# EAGLE design SeismicPi (EAGLE 7.3.0)
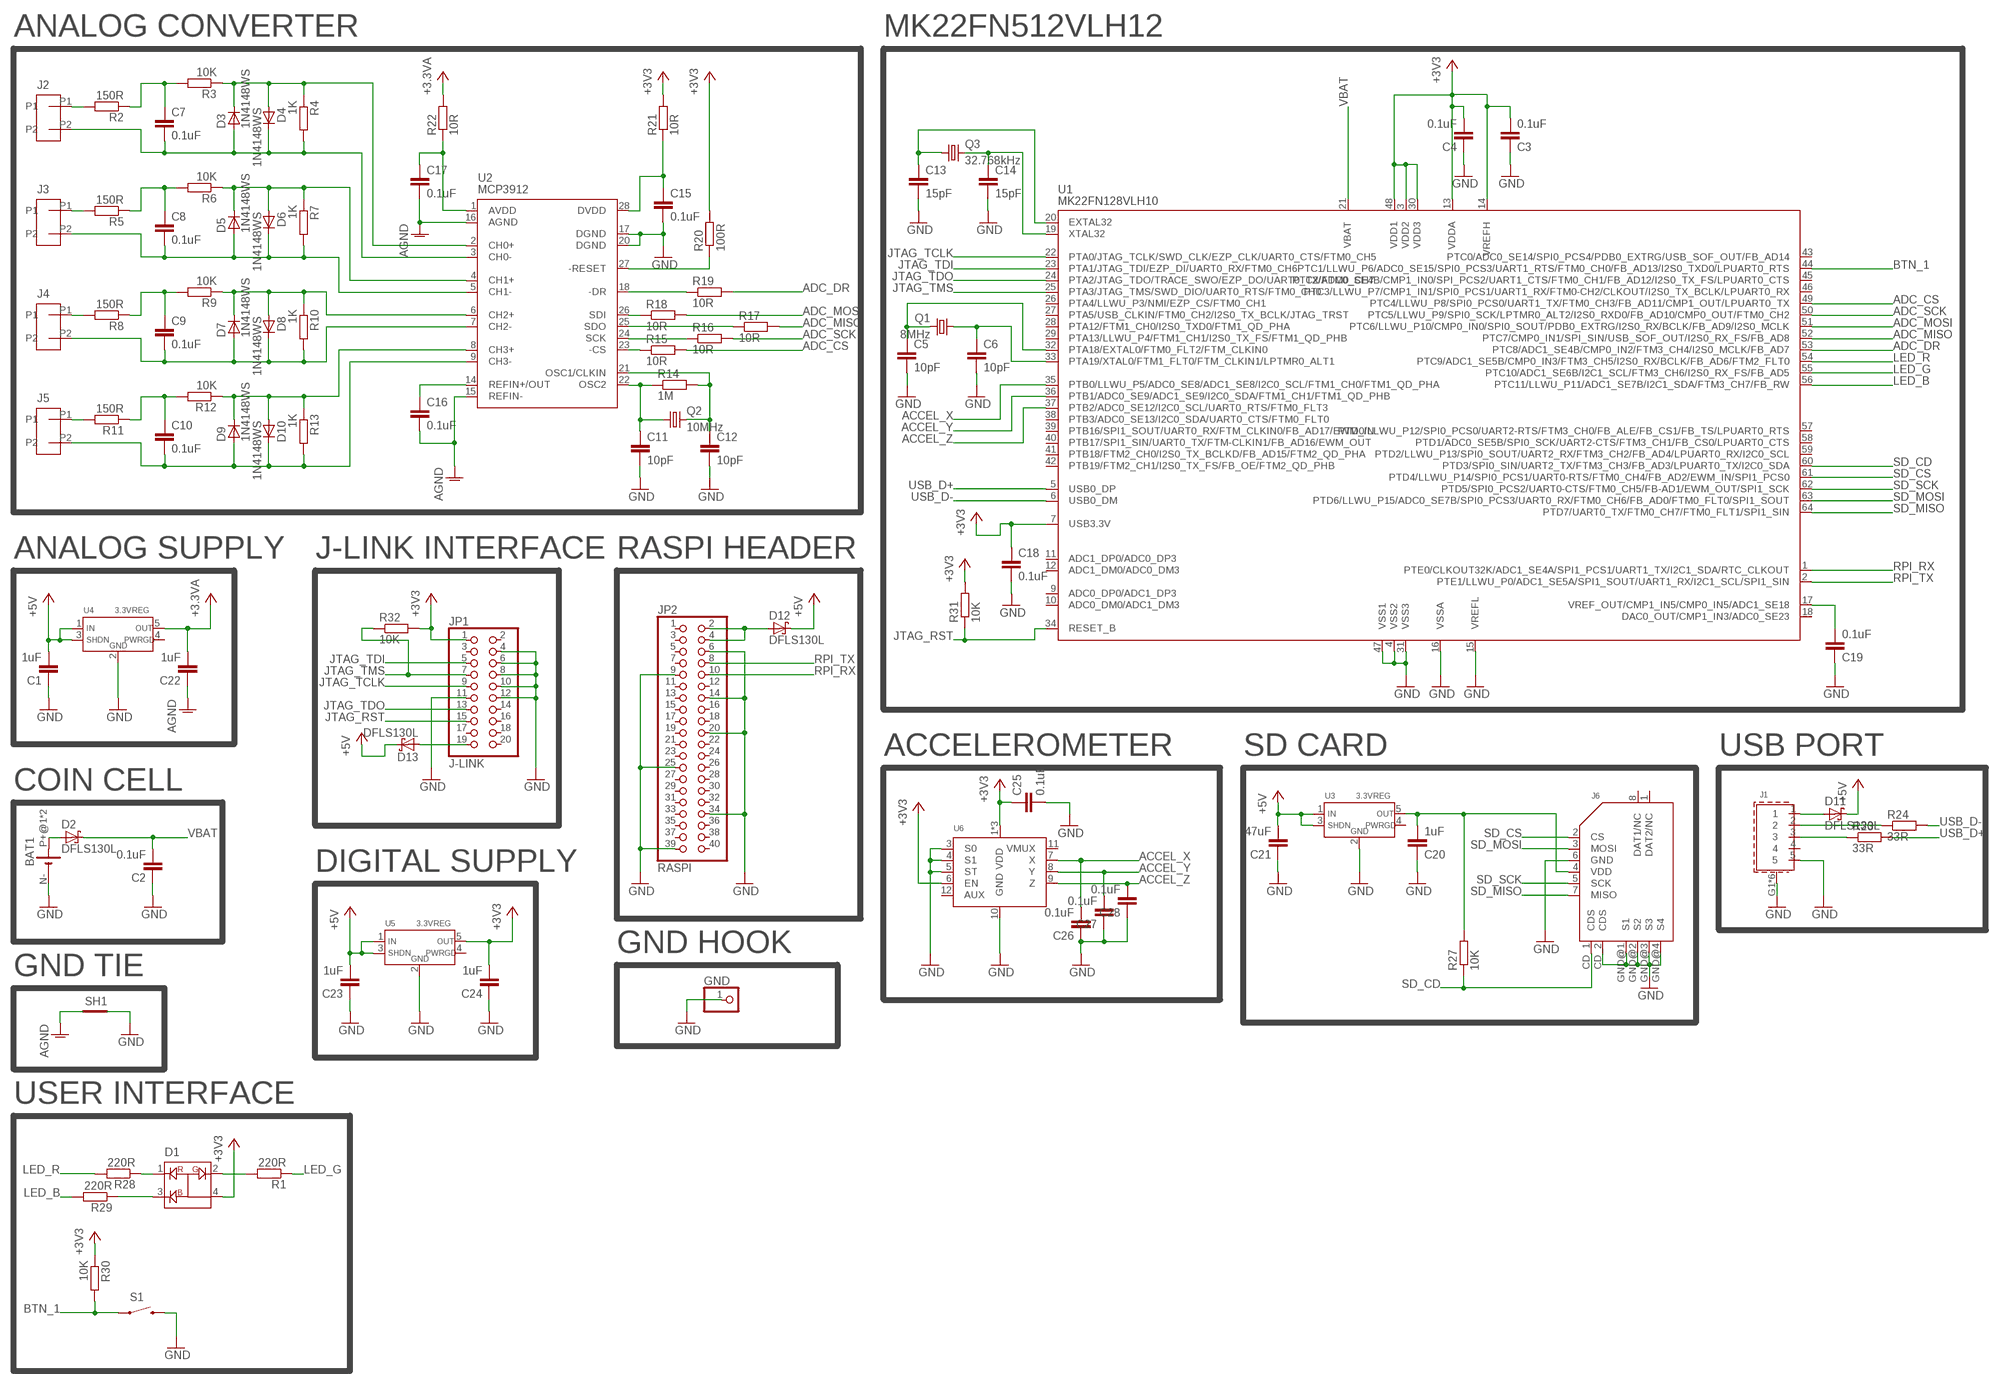
[diagram p0: schematic, sheet 1]

## Parts
BAT1  BATTERY-HOLDER_11.6MM  [CELL_RETAINER_11.6MM]
C1  1uF  C-EUC2012  [C2012]
C2  0.1uF  C-EUC2012  [C2012]
C3  0.1uF  C-EUC2012  [C2012]
C4  0.1uF  C-EUC2012  [C2012]
C5  10pF  C-EUC2012  [C2012]
C6  10pF  C-EUC2012  [C2012]
C7  0.1uF  C-EUC2012  [C2012]
C8  0.1uF  C-EUC2012  [C2012]
C9  0.1uF  C-EUC2012  [C2012]
C10  0.1uF  C-EUC2012  [C2012]
C11  10pF  C-EUC2012  [C2012]
C12  10pF  C-EUC2012  [C2012]
C13  15pF  C-EUC2012  [C2012]
C14  15pF  C-EUC2012  [C2012]
C15  0.1uF  C-EUC2012  [C2012]
C16  0.1uF  C-EUC2012  [C2012]
C17  0.1uF  C-EUC2012  [C2012]
C18  0.1uF  C-EUC2012  [C2012]
C19  0.1uF  C-EUC2012  [C2012]
C20  1uF  C-EUC2012  [C2012]
C21  47uF  C-EUC2012  [C2012]
C22  1uF  C-EUC2012  [C2012]
C23  1uF  C-EUC2012  [C2012]
C24  1uF  C-EUC2012  [C2012]
C25  0.1uF  C-EUC2012  [C2012]
C26  0.1uF  C-EUC2012  [C2012]
C27  0.1uF  C-EUC2012  [C2012]
C28  0.1uF  C-EUC2012  [C2012]
D1  RGB-LED  [P-LCC4-0]
D2  DFLS130L  [POWERDI323]
D3  1N4148WS  [SOD323]
D4  1N4148WS  [SOD323]
D5  1N4148WS  [SOD323]
D6  1N4148WS  [SOD323]
D7  1N4148WS  [SOD323]
D8  1N4148WS  [SOD323]
D9  1N4148WS  [SOD323]
D10  1N4148WS  [SOD323]
D11  DFLS130L  [POWERDI323]
D12  DFLS130L  [POWERDI323]
D13  DFLS130L  [POWERDI323]
GND  PINHD-1X1  [1X01]
J1  USB-CONNMICRO  [MICRO-USB]
J2  2WAY-TERMINAL  [2WAY-5.08]
J3  2WAY-TERMINAL  [2WAY-5.08]
J4  2WAY-TERMINAL  [2WAY-5.08]
J5  2WAY-TERMINAL  [2WAY-5.08]
J6  MICRO-SD  [MICRO-SD]
JP1  J-LINK  PINHD-2X10  [2X10]
JP2  RASPI  PINHD-2X20  [2X20]
Q1  8MHz  CRYSTAL  [ABM3B]
Q2  10MHz  CRYSTAL  [ABM3B]
Q3  32.768kHz  CRYSTALMM20SS  [MM20SS]
R1  220R  R-EU_M2012  [M2012]
R2  150R  R-EU_M2012  [M2012]
R3  10K  R-EU_M2012  [M2012]
R4  1K  R-EU_M2012  [M2012]
R5  150R  R-EU_M2012  [M2012]
R6  10K  R-EU_M2012  [M2012]
R7  1K  R-EU_M2012  [M2012]
R8  150R  R-EU_M2012  [M2012]
R9  10K  R-EU_M2012  [M2012]
R10  1K  R-EU_M2012  [M2012]
R11  150R  R-EU_M2012  [M2012]
R12  10K  R-EU_M2012  [M2012]
R13  1K  R-EU_M2012  [M2012]
R14  1M  R-EU_M2012  [M2012]
R15  10R  R-EU_M2012  [M2012]
R16  10R  R-EU_M2012  [M2012]
R17  10R  R-EU_M2012  [M2012]
R18  10R  R-EU_M2012  [M2012]
R19  10R  R-EU_M2012  [M2012]
R20  100R  R-EU_M2012  [M2012]
R21  10R  R-EU_M2012  [M2012]
R22  10R  R-EU_M2012  [M2012]
R23  33R  R-EU_M2012  [M2012]
R24  33R  R-EU_M2012  [M2012]
R27  10K  R-EU_M2012  [M2012]
R28  220R  R-EU_M2012  [M2012]
R29  220R  R-EU_M2012  [M2012]
R30  10K  R-EU_M2012  [M2012]
R31  10K  R-EU_M2012  [M2012]
R32  10K  R-EU_M2012  [M2012]
S1  SWITCH-MOMENTARY-2PTH  [TACTILE-PTH]
SH1  SHORT-HT5  [SHORT_TOP-50]
U1  MK22FN128VLH10  [LQFP-64_10X10X1.6]
U2  MCP3912  [SSOP28]
U3  3.3VREG  [SOT23-5]
U4  3.3VREG  [SOT23-5]
U5  3.3VREG  [SOT23-5]
U6  KXRB5-2050  [LGA-14]

## Nets
+3V3: C3.2 C4.2 C18.1 C24.2 C25.1 D1.4(AN) JP1.1 R20.2 R21.2 R30.1 R31.2 R32.2 U1.3(VDD2) U1.7(USB3.3V) U1.13(VDDA) U1.14(VREFH) U1.30(VDD3) U1.48(VDD1) U5.5(OUT) U6.1(VDD) U6.6(EN) U6.13(VDD) U6.14(VDD)
+3V3A: C22.2 R22.2 U4.5(OUT) ; supply symbol labelled +3.3VA
+5V: C1.2 C21.2 C23.2 D11.C D12.C D13.C U3.1(IN) U3.3(SHDN) U4.1(IN) U4.3(SHDN) U5.1(IN) U5.3(SHDN)
ACCEL_X: C26.2 U1.35(PTB0/LLWU_P5/ADC0_SE8/ADC1_SE8/I2C0_SCL/FTM1_CH0/FTM1_QD_PHA) U6.7(X)
ACCEL_Y: C27.2 U1.36(PTB1/ADC0_SE9/ADC1_SE9/I2C0_SDA/FTM1_CH1/FTM1_QD_PHB) U6.8(Y)
ACCEL_Z: C28.2 U1.37(PTB2/ADC0_SE12/I2C0_SCL/UART0_RTS/FTM0_FLT3) U6.9(Z)
ADC_CS: R15.2 U1.49(PTC4/LLWU_P8/SPI0_PCS0/UART1_TX/FTM0_CH3/FB_AD11/CMP1_OUT/LPUART0_TX)
ADC_DR: R19.2 U1.53(PTC8/ADC1_SE4B/CMP0_IN2/FTM3_CH4/I2S0_MCLK/FB_AD7)
ADC_MISO: R17.2 U1.52(PTC7/CMP0_IN1/SPI_SIN/USB_SOF_OUT/I2S0_RX_FS/FB_AD8)
ADC_MOSI: R18.2 U1.51(PTC6/LLWU_P10/CMP0_IN0/SPI0_SOUT/PDB0_EXTRG/I2S0_RX/BCLK/FB_AD9/I2S0_MCLK)
ADC_SCK: R16.2 U1.50(PTC5/LLWU_P9/SPI0_SCK/LPTMR0_ALT2/I2S0_RXD0/FB_AD10/CMP0_OUT/FTM0_CH2)
AGND: C16.2 C17.2 C22.1 SH1.1 U2.15(REFIN-) U2.16(AGND)
BTN_1: R30.2 S1.1 U1.44(PTC1/LLWU_P6/ADC0_SE15/SPI0_PCS3/UART1_RTS/FTM0_CH0/FB_AD13/I2S0_TXD0/LPUART0_RTS)
GND: BAT1.N-(-) C1.1 C2.1 C3.1 C4.1 C5.2 C6.2 C11.2 C12.2 C13.2 C14.2 C15.2 C18.2 C19.1 C20.1 C21.1 C23.1 C24.1 C25.2 C26.1 C27.1 C28.1 GND.1 J1.5 J1.G1(GND) J1.G2(GND) J1.G3(GND) J1.G4(GND) J1.G5(GND) J1.G6(GND) J6.6(GND) J6.CD_2(CDS) J6.GND@1(S1) J6.GND@2(S2) J6.GND@3(S3) J6.GND@4(S4) JP1.4 JP1.6 JP1.8 JP1.10 JP1.11 JP1.12 JP2.6 JP2.9 JP2.14 JP2.20 JP2.25 JP2.34 JP2.39 S1.3 SH1.2 U1.4(VSS2) U1.15(VREFL) U1.16(VSSA) U1.31(VSS3) U1.47(VSS1) U2.17(DGND) U2.20(DGND) U3.2(GND) U4.2(GND) U5.2(GND) U6.3(S0) U6.4(S1) U6.5(ST) U6.10(GND)
JTAG_RST: JP1.15 R31.1 U1.34(RESET_B)
JTAG_TCLK: JP1.9 U1.22(PTA0/JTAG_TCLK/SWD_CLK/EZP_CLK/UART0_CTS/FTM0_CH5)
JTAG_TDI: JP1.5 U1.23(PTA1/JTAG_TDI/EZP_DI/UART0_RX/FTM0_CH6)
JTAG_TDO: JP1.13 U1.24(PTA2/JTAG_TDO/TRACE_SWO/EZP_DO/UART0_TX/FTM0_CH7)
JTAG_TMS: JP1.7 R32.1 U1.25(PTA3/JTAG_TMS/SWD_DIO/UART0_RTS/FTM0_CH0)
LED_B: R29.2 U1.56(PTC11/LLWU_P11/ADC1_SE7B/I2C1_SDA/FTM3_CH7/FB_RW)
LED_G: R1.1 U1.55(PTC10/ADC1_SE6B/I2C1_SCL/FTM3_CH6/I2S0_RX_FS/FB_AD5)
LED_R: R28.2 U1.54(PTC9/ADC1_SE5B/CMP0_IN3/FTM3_CH5/I2S0_RX/BCLK/FB_AD6/FTM2_FLT0)
N$1: D11.A J1.1
N$2: BAT1.P+@1(+) BAT1.P+@2(+) D2.A
N$3: J2.P1 R2.2
N$4: C5.1 Q1.3 U1.32(PTA18/EXTAL0/FTM0_FLT2/FTM_CLKIN0)
N$5: C6.1 Q1.1 U1.33(PTA19/XTAL0/FTM1_FLT0/FTM_CLKIN1/LPTMR0_ALT1)
N$6: D3.1(C) D4.2(A) R3.1 R4.1 U2.2(CH0+)
N$7: C7.2 D3.2(A) D4.1(C) J2.P2 R4.2 U2.3(CH0-)
N$8: C12.1 Q2.3 R14.2 U2.21(OSC1/CLKIN)
N$9: J3.P1 R5.2
N$10: C13.1 Q3.1 U1.20(EXTAL32)
N$11: C14.1 Q3.4 U1.19(XTAL32)
N$12: C7.1 R2.1 R3.2
N$13: D5.1(C) D6.2(A) R6.1 R7.1 U2.4(CH1+)
N$14: C8.2 D5.2(A) D6.1(C) J3.P2 R7.2 U2.5(CH1-)
N$15: C8.1 R5.1 R6.2
N$16: J4.P1 R8.2
N$17: D7.1(C) D8.2(A) R9.1 R10.1 U2.6(CH2+)
N$18: C9.2 D7.2(A) D8.1(C) J4.P2 R10.2 U2.7(CH2-)
N$19: C9.1 R8.1 R9.2
N$20: J5.P1 R11.2
N$21: D9.1(C) D10.2(A) R12.1 R13.1 U2.8(CH3+)
N$22: C10.2 D9.2(A) D10.1(C) J5.P2 R13.2 U2.9(CH3-)
N$23: C10.1 R11.1 R12.2
N$24: C11.1 Q2.1 R14.1 U2.22(OSC2)
N$25: C16.1 U2.14(REFIN+/OUT)
N$26: R20.1 U2.27(-RESET)
N$27: C17.1 R22.1 U2.1(AVDD)
N$28: R19.1 U2.18(-DR)
N$29: R18.1 U2.26(SDI)
N$30: R17.1 U2.25(SDO)
N$31: R16.1 U2.24(SCK)
N$32: R15.1 U2.23(-CS)
N$33: C19.2 U1.17(VREF_OUT/CMP1_IN5/CMP0_IN5/ADC1_SE18)
N$34: D12.A JP2.2 JP2.4
N$35: D1.1(R) R28.1
N$36: D1.3(B) R29.1
N$37: D1.2(G) R1.2
N$38: C15.1 R21.1 U2.28(DVDD)
N$41: J1.2 R24.1
N$42: J1.3 R23.1
N$47: D13.A JP1.19
N$50: C20.2 J6.4(VDD) R27.2 U3.5(OUT)
RPI_RX: JP2.10 U1.1(PTE0/CLKOUT32K/ADC1_SE4A/SPI1_PCS1/UART1_TX/I2C1_SDA/RTC_CLKOUT)
RPI_TX: JP2.8 U1.2(PTE1/LLWU_P0/ADC1_SE5A/SPI1_SOUT/UART1_RX/I2C1_SCL/SPI1_SIN)
SD_CD: J6.CD_1(CDS) R27.1 U1.60(PTD3/SPI0_SIN/UART2_TX/FTM3_CH3/FB_AD3/LPUART0_TX/I2C0_SDA)
SD_CS: J6.2(CS) U1.61(PTD4/LLWU_P14/SPI0_PCS1/UART0-RTS/FTM0_CH4/FB_AD2/EWM_IN/SPI1_PCS0)
SD_MISO: J6.7(MISO) U1.64(PTD7/UART0_TX/FTM0_CH7/FTM0_FLT1/SPI1_SIN)
SD_MOSI: J6.3(MOSI) U1.63(PTD6/LLWU_P15/ADC0_SE7B/SPI0_PCS3/UART0_RX/FTM0_CH6/FB_AD0/FTM0_FLT0/SPI1_SOUT)
SD_SCK: J6.5(SCK) U1.62(PTD5/SPI0_PCS2/UART0-CTS/FTM0_CH5/FB-AD1/EWM_OUT/SPI1_SCK)
USB_D+: R23.2 U1.5(USB0_DP)
USB_D-: R24.2 U1.6(USB0_DM)
VBAT: C2.2 D2.C U1.21(VBAT)
Unconnected: J1.4 J6.1(DAT2/NC) J6.8(DAT1/NC) JP1.2 JP1.3 JP1.14 JP1.16 JP1.17 JP1.18 JP1.20 JP2.1 JP2.3 JP2.5 JP2.7 JP2.11 JP2.12 JP2.13 JP2.15 JP2.16 JP2.17 JP2.18 JP2.19 JP2.21 JP2.22 JP2.23 JP2.24 JP2.26 JP2.27 JP2.28 JP2.29 JP2.30 JP2.31 JP2.32 JP2.33 JP2.35 JP2.36 JP2.37 JP2.38 JP2.40 U1.9(ADC0_DP0/ADC1_DP3) U1.10(ADC0_DM0/ADC1_DM3) U1.11(ADC1_DP0/ADC0_DP3) U1.12(ADC1_DM0/ADC0_DM3) U1.18(DAC0_OUT/CMP1_IN3/ADC0_SE23) U1.26(PTA4/LLWU_P3/NMI/EZP_CS/FTM0_CH1) U1.27(PTA5/USB_CLKIN/FTM0_CH2/I2S0_TX_BCLK/JTAG_TRST) U1.28(PTA12/FTM1_CH0/I2S0_TXD0/FTM1_QD_PHA) U1.29(PTA13/LLWU_P4/FTM1_CH1/I2S0_TX_FS/FTM1_QD_PHB) U1.38(PTB3/ADC0_SE13/I2C0_SDA/UART0_CTS/FTM0_FLT0) U1.39(PTB16/SPI1_SOUT/UART0_RX/FTM_CLKIN0/FB_AD17/EWM_IN) U1.40(PTB17/SPI1_SIN/UART0_TX/FTM-CLKIN1/FB_AD16/EWM_OUT) U1.41(PTB18/FTM2_CH0/I2S0_TX_BCLKD/FB_AD15/FTM2_QD_PHA) U1.42(PTB19/FTM2_CH1/I2S0_TX_FS/FB_OE/FTM2_QD_PHB) U1.43(PTC0/ADC0_SE14/SPI0_PCS4/PDB0_EXTRG/USB_SOF_OUT/FB_AD14) U1.45(PTC2/ADC0_SE4B/CMP1_IN0/SPI_PCS2/UART1_CTS/FTM0_CH1/FB_AD12/I2S0_TX_FS/LPUART0_CTS) U1.46(PTC3/LLWU_P7/CMP1_IN1/SPI0_PCS1/UART1_RX/FTM0-CH2/CLKOUT/I2S0_TX_BCLK/LPUART0_RX) U1.57(PTD0/LLWU_P12/SPI0_PCS0/UART2-RTS/FTM3_CH0/FB_ALE/FB_CS1/FB_TS/LPUART0_RTS) U1.58(PTD1/ADC0_SE5B/SPI0_SCK/UART2-CTS/FTM3_CH1/FB_CS0/LPUART0_CTS) U1.59(PTD2/LLWU_P13/SPI0_SOUT/UART2_RX/FTM3_CH2/FB_AD4/LPUART0_RX/I2C0_SCL) U3.4(PWRGD) U4.4(PWRGD) U5.4(PWRGD) U6.11(VMUX) U6.12(AUX)

## Notes on the sheet
- ANALOG CONVERTER | MK22FN512VLH12
- ANALOG SUPPLY | J-LINK INTERFACE | RASPI HEADER
- ACCELEROMETER | SD CARD | USB PORT
- COIN CELL
- DIGITAL SUPPLY
- GND HOOK
- GND TIE
- USER INTERFACE

## Library data of the parts
BAT1 = battery:BATTERY-HOLDER_11.6MM: 11.6mm PC BUTTON CELL RETAINER, high 5.97mm KEYSTONE ELECTRONICS CORP. Data sheet <http://www.farnell.com/cad/1718310.pdf>; MF: KEYSTONE; MPN: 2997; OC_FARNELL: 2293265
C1-C28 = resistor:C-EU: CAPACITOR, European symbol
D1 = bgs-datalogger:RGB-LED
D2 D11-D13 = bgs-datalogger:DFLS130L
D3-D10 = bgs-datalogger:1N4148WS
GND = pinhead:PINHD-1X1: PIN HEADER
J1 = bgs-datalogger:USB-CONN
J2-J5 = bgs-datalogger:2WAY-TERMINAL
J6 = bgs-datalogger:MICRO-SD
JP1 = pinhead:PINHD-2X10: PIN HEADER
JP2 = pinhead:PINHD-2X20: PIN HEADER
Q1 Q2 = crystal:CRYSTAL: CRYSTAL
Q3 = crystal:CRYSTAL: CRYSTAL; OC_FARNELL: unknown; OC_NEWARK: unknown
R1-R24 R27-R32 = resistor:R-EU_: RESISTOR, European symbol
S1 = SparkFun-Electromechanical:SWITCH-MOMENTARY-2: Various NO switches- pushbuttons, reed, etc; PROD_ID: SWCH-08441
SH1 = shorts-old:SHORT-H: Short between two nets; BOM: no
U1 = bgs-datalogger:MK22FN128VLH10
U2 = bgs-datalogger:MCP3912
U3-U5 = bgs-datalogger:3.3VREG
U6 = bgs-datalogger:KXRB5-2050

## Board
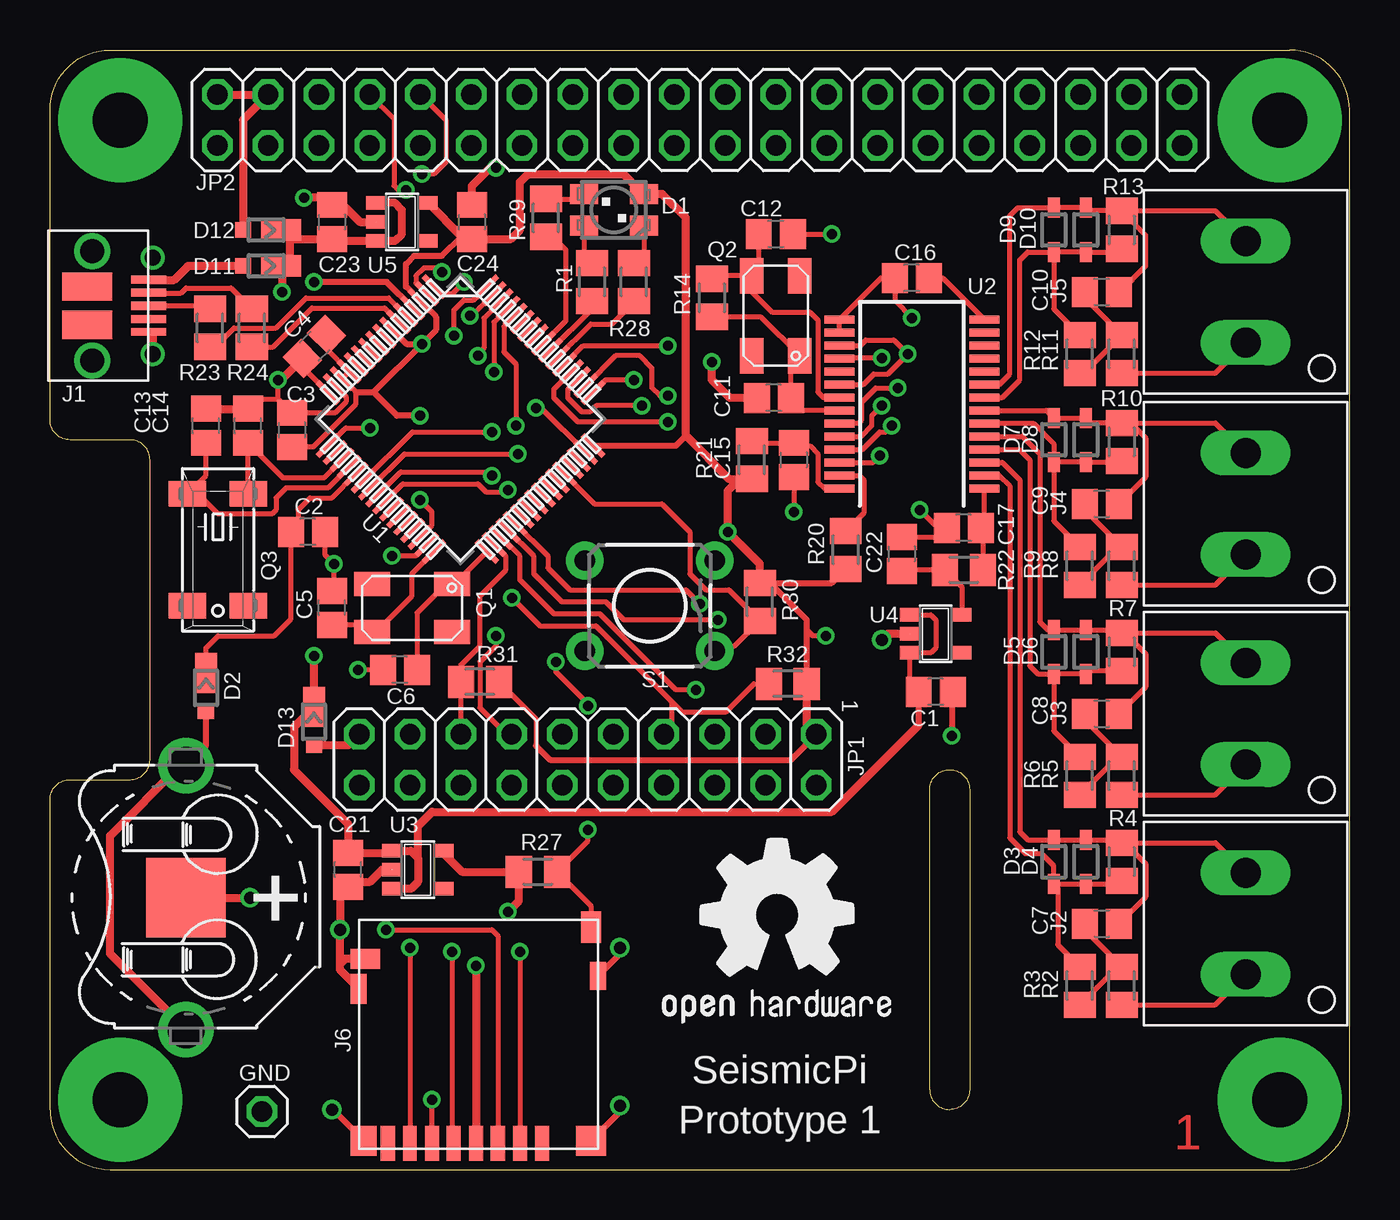
[diagram p1: board, top side]
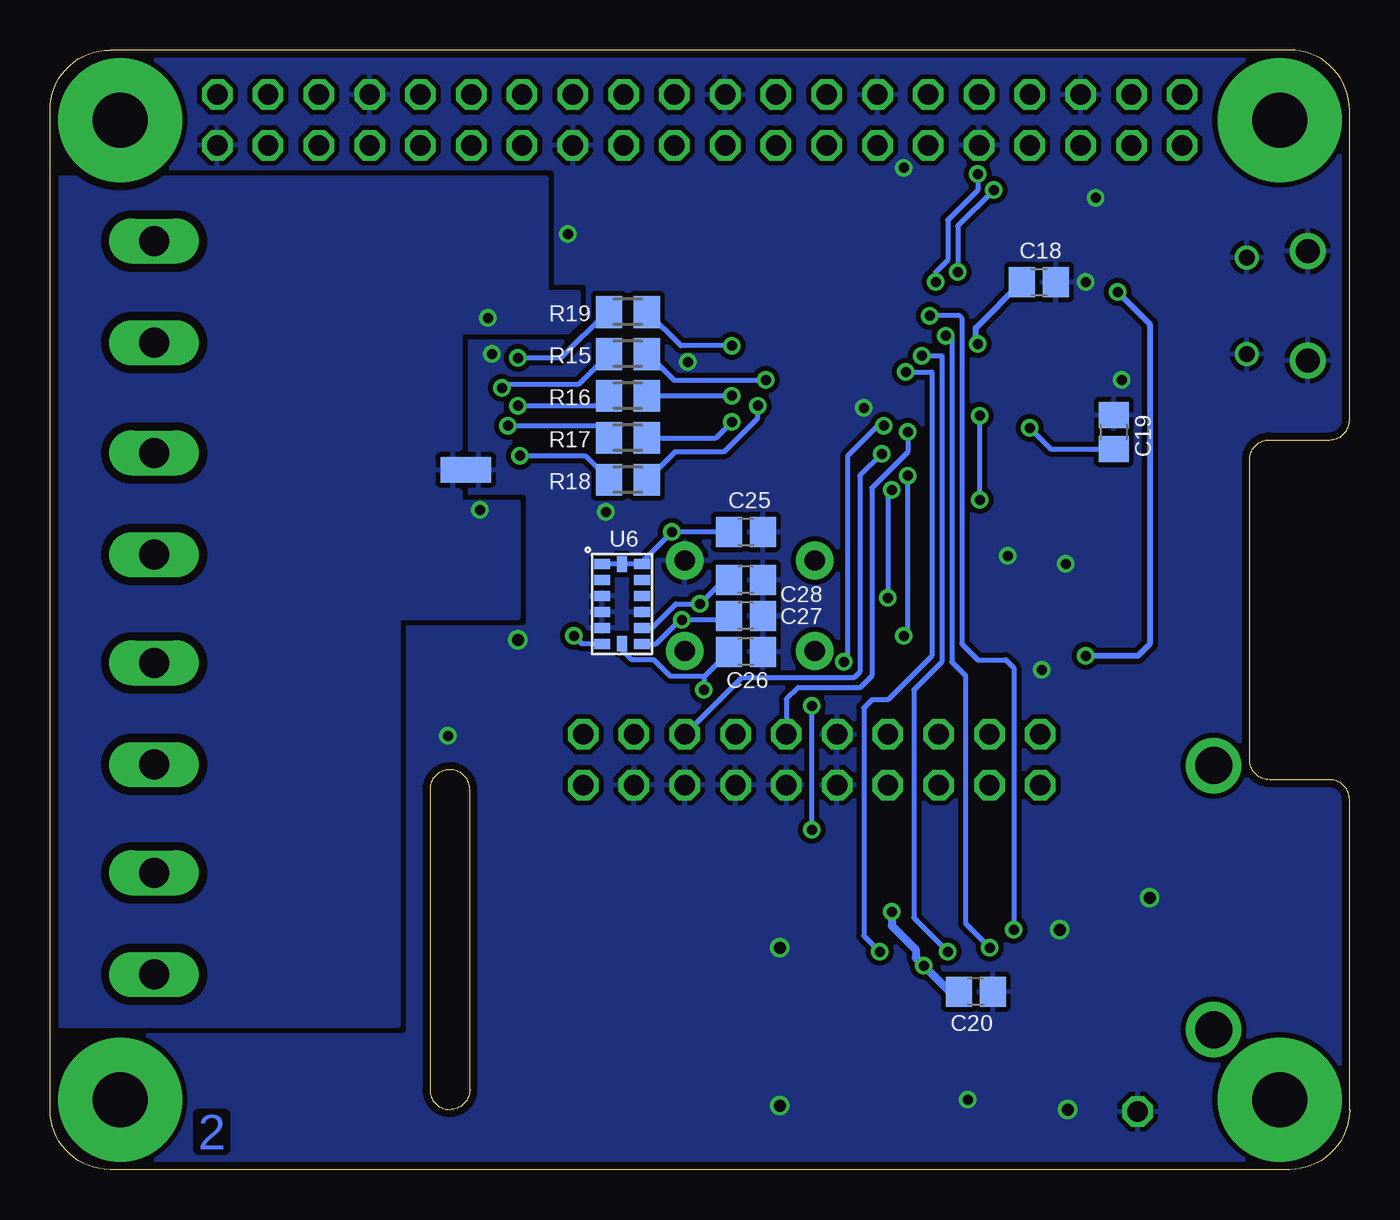
[diagram p2: board, bottom side, seen from below]

Size 65 x 56 mm. Coordinates in mm from the lower left corner, seen from the top.
Outline: 65,3 65,53 arc90 62,56 3,56 arc90 0,53 0,37.5 arc90 1,36.5 4,36.5 arc-90 5,35.5 5,20.5 arc-90 4,19.5 1,19.5 arc90 0,18.5 0,3 arc90 3,0 62,0 arc90 65,3
Outline: 44,4 arc90 45,3 arc90 46,4 46,19 arc90 45,20 arc90 44,19 44,4
Copper layers (1*16): Top 0.0356mm / dielectric 1.5011mm / Bottom 0.0356mm
Design rules "LaenPCBOrder *": minimum track width 6mil, minimum drill 13mil, track to track 6mil, track to pad 6mil, pad to pad 6mil, via to via 6mil, smd to smd 6mil, copper to edge 15mil, drill to drill 6mil, minimum pad ring 7mil, minimum via ring 7mil, stop-mask expansion 3mil, vias tented up to drill 0mil, thermal gap 10mil

### Footprints (pad centres in the part's own frame; a part is rotated, then mirrored left to right if it is on the bottom)
CELL_RETAINER_11.6MM = smd 3.96 x 3.96: N- 0,0 | drill 1.85 pad 2.54: P+@1 -6.605,0; P+@2 6.605,0
C2012 = smd 1.3 x 1.5: 1 -0.85,0; 2 0.85,0
P-LCC4-0 = smd 1 x 1.4: 1 -0.787,-1.5; 2 -0.787,1.5; 3 0.787,1.5; 4 0.787,-1.5
POWERDI323 = smd 0.8 x 0.8: A 1.15,0 | smd 2 x 1.1: C -0.75,0
SOD323 = smd 1 x 0.6: 1 -1.1,0; 2 1.1,0
1X01 = drill 1.016 octagon: 1 0,0
MICRO-USB = smd 0.4 x 1.75: 1 -1.3,2.825; 2 -0.65,2.825; 3 0,2.825; 4 0.65,2.825; 5 1.3,2.825 | drill 1.2: G1 -2.725,0; G2 2.725,0 | drill 0.8: G3 2.425,3.03; G4 -2.425,3.03 | smd 1.425 x 2.5: G5 -0.963,-0.25; G6 0.963,-0.25
2WAY-5.08 = drill 1.5 long: P1 -2.54,0; P2 2.54,0
MICRO-SD = smd 0.7 x 1.75: 1 7.7,-0.875; 2 6.6,-0.875; 3 5.5,-0.875; 4 4.4,-0.875; 5 3.3,-0.875; 6 2.2,-0.875; 7 1.1,-0.875; 8 0,-0.875 | smd 1 x 1.55: CD_1 10.15,9.925 | smd 1.45 x 1: CD_2 -1.125,8.35 | smd 1.5 x 1.5: GND@1 10.15,-0.75 | smd 1.3 x 1.5: GND@2 -1.2,-0.75 | smd 0.8 x 1.5: GND@3 -1.45,6.85 | smd 0.8 x 1.4: GND@4 10.5,7.5
2X10 = drill 1.016 octagon: 1 -11.43,-1.27; 2 -11.43,1.27; 3 -8.89,-1.27; 4 -8.89,1.27; 5 -6.35,-1.27; 6 -6.35,1.27; 7 -3.81,-1.27; 8 -3.81,1.27; 9 -1.27,-1.27; 10 -1.27,1.27; 11 1.27,-1.27; 12 1.27,1.27; 13 3.81,-1.27; 14 3.81,1.27; 15 6.35,-1.27; 16 6.35,1.27; 17 8.89,-1.27; 18 8.89,1.27; 19 11.43,-1.27; 20 11.43,1.27
2X20 = drill 1.016 octagon: 1 -24.13,-1.27; 2 -24.13,1.27; 3 -21.59,-1.27; 4 -21.59,1.27; 5 -19.05,-1.27; 6 -19.05,1.27; 7 -16.51,-1.27; 8 -16.51,1.27; 9 -13.97,-1.27; 10 -13.97,1.27; 11 -11.43,-1.27; 12 -11.43,1.27; 13 -8.89,-1.27; 14 -8.89,1.27; 15 -6.35,-1.27; 16 -6.35,1.27; 17 -3.81,-1.27; 18 -3.81,1.27; 19 -1.27,-1.27; 20 -1.27,1.27; 21 1.27,-1.27; 22 1.27,1.27; 23 3.81,-1.27; 24 3.81,1.27; 25 6.35,-1.27; 26 6.35,1.27; 27 8.89,-1.27; 28 8.89,1.27; 29 11.43,-1.27; 30 11.43,1.27; 31 13.97,-1.27; 32 13.97,1.27; 33 16.51,-1.27; 34 16.51,1.27; 35 19.05,-1.27; 36 19.05,1.27; 37 21.59,-1.27; 38 21.59,1.27; 39 24.13,-1.27; 40 24.13,1.27
ABM3B = smd 1.8 x 1.2: 1 -2,-1.2; 2 2,-1.2; 3 2,1.2; 4 -2,1.2
MM20SS = smd 1.27 x 1.88: 1 -2.794,-1.524; 2 2.794,-1.524; 3 2.794,1.524; 4 -2.794,1.524
M2012 = smd 1.3 x 1.6: 1 -0.95,0; 2 0.95,0
TACTILE-PTH = drill 1.016 pad 1.88: 1 -3.251,2.261; 2 3.251,2.261; 3 -3.251,-2.261; 4 3.251,-2.261
SHORT_TOP-50 = smd 1.27 x 1.27: 1 0.635,0; 2 -0.635,0
LQFP-64_10X10X1.6 = smd 1.473 x 0.279: 1 -5.625,3.75; 2 -5.625,3.25; 3 -5.625,2.75; 4 -5.625,2.25; 5 -5.625,1.75; 6 -5.625,1.25; 7 -5.625,0.75; 8 -5.625,0.25; 9 -5.625,-0.25; 10 -5.625,-0.75; 11 -5.625,-1.25; 12 -5.625,-1.75; 13 -5.625,-2.25; 14 -5.625,-2.75; 15 -5.625,-3.25; 16 -5.625,-3.75; 33 5.625,-3.75; 34 5.625,-3.25; 35 5.625,-2.75; 36 5.625,-2.25; 37 5.625,-1.75; 38 5.625,-1.25; 39 5.625,-0.75; 40 5.625,-0.25; 41 5.625,0.25; 42 5.625,0.75; 43 5.625,1.25; 44 5.625,1.75; 45 5.625,2.25; 46 5.625,2.75; 47 5.625,3.25; 48 5.625,3.75 | smd 0.279 x 1.473: 17 -3.75,-5.625; 18 -3.25,-5.625; 19 -2.75,-5.625; 20 -2.25,-5.625; 21 -1.75,-5.625; 22 -1.25,-5.625; 23 -0.75,-5.625; 24 -0.25,-5.625; 25 0.25,-5.625; 26 0.75,-5.625; 27 1.25,-5.625; 28 1.75,-5.625; 29 2.25,-5.625; 30 2.75,-5.625; 31 3.25,-5.625; 32 3.75,-5.625; 49 3.75,5.625; 50 3.25,5.625; 51 2.75,5.625; 52 2.25,5.625; 53 1.75,5.625; 54 1.25,5.625; 55 0.75,5.625; 56 0.25,5.625; 57 -0.25,5.625; 58 -0.75,5.625; 59 -1.25,5.625; 60 -1.75,5.625; 61 -2.25,5.625; 62 -2.75,5.625; 63 -3.25,5.625; 64 -3.75,5.625
SSOP28 = smd 0.4 x 1.5: 1 -4.225,-3.625; 2 -3.575,-3.625; 3 -2.925,-3.625; 4 -2.275,-3.625; 5 -1.625,-3.625; 6 -0.975,-3.625; 7 -0.325,-3.625; 8 0.325,-3.625; 9 0.975,-3.625; 10 1.625,-3.625; 11 2.275,-3.625; 12 2.925,-3.625; 13 3.575,-3.625; 14 4.225,-3.625; 15 4.225,3.625; 16 3.575,3.625; 17 2.925,3.625; 18 2.275,3.625; 19 1.625,3.625; 20 0.975,3.625; 21 0.325,3.625; 22 -0.325,3.625; 23 -0.975,3.625; 24 -1.625,3.625; 25 -2.275,3.625; 26 -2.925,3.625; 27 -3.575,3.625; 28 -4.225,3.625
SOT23-5 = smd 0.69 x 0.99: 1 -0.95,-1.29; 2 0,-1.29; 3 0.95,-1.29; 4 0.95,1.3; 5 -0.95,1.3
LGA-14 = smd 0.8 x 0.5: 1 -1,2; 2 -1,1.2; 3 -1,0.4; 4 -1,-0.4; 5 -1,-1.2; 6 -1,-2; 8 1,-2; 9 1,-1.2; 10 1,-0.4; 11 1,0.4; 12 1,1.2; 13 1,2 | smd 0.5 x 0.8: 7 0,-2; 14 0,2

### Placement (x,y rotation side)
BAT1  6.8,13.6 90 top
C1  44.3,23.9 180 top
C2  12.9,31.9 180 top
C3  12.1,37 270 top
C4  13.23,41.17 45 top
C5  14.1,28.1 90 top
C6  17.5,25 180 top
C7  52.6,12.3 0 top
C8  52.6,22.8 0 top
C9  52.6,33.3 0 top
C10  52.6,43.9 0 top
C11  36.2,38.6 180 top
C12  36.3,46.8 0 top
C13  7.8,37.2 90 top
C14  9.9,37.2 90 top
C15  37.2,35.5 270 top
C16  43.1,44.6 180 top
C17  45.7,32.1 180 top
C18  15.54,44.39 0 bottom
C19  11.8,36.9 270 bottom
C20  18.7,8.9 180 bottom
C21  14.9,15 90 top
C22  42.6,30.8 270 top
C23  14.1,47.4 270 top
C24  21.1,47.4 270 top
C25  30.2,31.9 0 bottom
C26  30.2,25.9 180 bottom
C27  30.2,27.7 180 bottom
C28  30.2,29.5 180 bottom
D1  28.2,48 90 top
D2  7.8,24.1 270 top
D3  50.2,15.4 90 top
D4  51.8,15.4 270 top
D5  50.2,25.9 90 top
D6  51.8,25.9 270 top
D7  50.2,36.5 90 top
D8  51.8,36.5 270 top
D9  50.2,47 90 top
D10  51.8,47 270 top
D11  10.8,45.2 180 top
D12  10.8,47 180 top
D13  13.2,22.4 270 top
GND  10.6,2.9 0 top
J1  2.1,43.2 270 top
J2  59.8,12.3 90 top
J3  59.8,22.8 90 top
J4  59.8,33.3 90 top
J5  59.8,43.9 90 top
J6  16.9,2.2 0 top
JP1  26.9,20.5 180 top
JP2  32.5,52.5 0 top
Q1  18.1,28.1 180 top
Q2  36.3,42.7 90 top
Q3  8.4,31 270 top
R1  27.1,44.4 90 top
R2  53.6,9.2 270 top
R3  51.5,9.2 270 top
R4  53.6,15.4 90 top
R5  53.6,19.7 270 top
R6  51.5,19.7 270 top
R7  53.6,25.9 90 top
R8  53.6,30.2 270 top
R9  51.5,30.2 270 top
R10  53.6,36.4 90 top
R11  53.6,40.8 270 top
R12  51.5,40.8 270 top
R13  53.6,47 90 top
R14  33.1,43.6 90 top
R15  36.1,40.8 0 bottom
R16  36.1,38.7 0 bottom
R17  36.1,36.6 0 bottom
R18  36.1,34.5 0 bottom
R19  36.1,42.9 0 bottom
R20  39.8,31 270 top
R21  35.1,35.5 270 top
R22  45.7,30 180 top
R23  8,42.1 270 top
R24  10.1,42.1 270 top
R27  24.4,14.9 180 top
R28  29.2,44.4 270 top
R29  24.8,47.6 270 top
R30  35.5,28.4 270 top
R31  21.5,24.4 0 top
R32  36.9,24.3 0 top
S1  30,28.2 180 top
SH1  44.2,35 180 bottom
U1  20.53,37.54 315 top
U2  43.1,38.3 90 top
U3  18.4,15 270 top
U4  44.3,26.8 270 top
U5  17.6,47.4 270 top
U6  36.4,28.3 0 bottom
U$1  [OSHW1]  30,5.6 0 top

### Tracks (layer width: path | path; a pad name or v marks a point on that pad's centre or on a via)
+3V3  (via drill 0.5)
  Top 0.254: C3.2 13.15,36.15 15.3,38.3 15.3,38.88 U1.14 | U1.14 | U1.14 U1.13 13.83,41.05 C4.2 | U1.30 19.1,32.22 19.1,32.9 v18.5,33.5 | R31.2 24.3,22.55 24.3,21.2 | v38.8,26.7 38.15,26.7 37.85,27
  Top 0.305: 20.57,46.67 19.6,45.7 18.2,45.7 17.8,45.3 17.8,44.16 U1.3 19.3,42.66 19.3,42 v18.6,41.3 | R30.1 36,29.35 | 36,29.35 39.1,29.35 R20.2 | R32.2 37.85,27 37.85,27.5 36,29.35 | U1.7 17.83,41.3 v18.6,41.3 | 15.3,38.88 16.18,38.88 | 16.18,38.88 v18.6,41.3 | v18.5,37.7 17.35,37.7 16.18,38.88 | 24.3,21.2 25,20.5 37.06,20.5 JP1.1 | U1.48 31.31,36.21 31.8,36.7
  Top 0.406: U5.5 20.57,46.67 20.7,46.55 C24.2 23.05,46.55 23.5,47 23.5,49.4 23.9,49.8 28.69,49.8 D1.4 30.61,48.79 31.8,47.6 31.8,36.7 33.95,34.55 34.5,34.55 | JP1.1 37.85,22.25 R32.2 | 34.5,34.55 R21.2 | 34.5,34.55 33.9,33.95 v33.9,31.9 35.5,30.3 R30.1
  Bottom 0.254: v18.5,33.5 v18.5,37.7 | U6.1 U6.14 U6.13 35.4,30.4 v33.9,31.9 C25.1 | U6.6 38.4,26.3 v38.8,26.7
  Bottom 0.305: v18.6,41.3 18.7,41.4 18.7,42.1 16.41,44.39 C18.1
+3V3A
  Top 0.254: U4.5 45.6,29.15 R22.2 42.65,30 C22.2
+5V  (via drill 0.5)
  Top 0.254: C1.2 43.01,24.34 U4.3 44.05,25.85 44.3,26.1 44.3,27.5 44.05,27.75 U4.1
  Top 0.305: v11.6,43.9 11.55,43.95 | 17.01,15.85 U3.1 | 43.45,22.25 C1.2
  Top 0.406: D12.C 12,46.55 | 12,46.55 C23.2 14.2,46.45 U5.3 17.25,46.45 17.6,46.8 17.6,48 17.25,48.35 U5.1 | 17.01,15.85 C21.2 14.9,17.3 12.2,20 12.2,22.15 D13.C v13.2,25.7 | U3.1 18.05,15.95 18.4,15.6 | 18.4,15.6 18.4,14.4 18.05,14.05 U3.3 | 18.4,15.6 18.4,17.2 19.1,17.9 39.1,17.9 43.45,22.25 | v11.6,43.9 11.6,45.15 D11.C 12,45.65 12,46.55
  Bottom 0.305: v13.2,25.7 10.6,25.7 10,26.3 10,42.3 v11.6,43.9
ACCEL_X  (via drill 0.5)
  Top 0.254: v32.3,24 31.3,24 27.5,27.8 25.2,27.8 23.5,29.5 23.5,30.68 U1.35
  Bottom 0.254: v32.3,24 32.3,24.65 C26.2 32.25,24.7 34,24.7 34.8,25.5 35.9,25.5 36.4,26 U6.7
ACCEL_Y  (via drill 0.5)
  Top 0.254: v33.4,27.5 28.7,27.5 27.8,28.4 25.6,28.4 24.2,29.8 24.2,30.68 U1.36
  Bottom 0.254: C27.2 31.25,27.5 v33.4,27.5 33.5,27.5 34.7,26.3 U6.8
ACCEL_Z  (via drill 0.5)
  Top 0.254: U1.37 24.9,30.69 24.9,30.1 26,29 31.8,29 v32.5,28.3
  Bottom 0.254: C28.2 31.3,29.5 v32.5,28.3 33.7,28.3 34.9,27.1 U6.9
ADC_CS  (via drill 0.5)
  Top 0.254: v29.2,39.5 27.8,39.5 U1.49
  Bottom 0.254: R15.2 35.1,40.8 33.8,39.5 v29.2,39.5
ADC_DR  (via drill 0.5)
  Top 0.254: U1.53 26.67,41.2 v30.9,41.2
  Bottom 0.254: v30.9,41.2 33.45,41.2 R19.2
ADC_MISO  (via drill 0.5)
  Top 0.254: v30.9,37.4 26.4,37.4 25.2,38.6 25.2,39.02 U1.52
  Bottom 0.254: R17.2 31.7,36.6 v30.9,37.4
ADC_MOSI  (via drill 0.5)
  Top 0.254: v29.6,38.2 27.3,38.2 27,37.9 26.6,37.9 25.9,38.6 25.9,39.02 U1.51
  Bottom 0.254: v29.6,38.2 29.6,37.6 31.3,35.9 33.75,35.9 R18.2
ADC_SCK  (via drill 0.5)
  Top 0.254: v30.9,38.7 30.5,38.7 30.1,39.1 30.1,40.1 29.5,40.7 28.29,40.7 U1.50
  Bottom 0.254: R16.2 v30.9,38.7
AGND  (via drill 0.5)
  Top 0.254: C22.1 44.4,31.65 C17.2 44.4,32.1 v43.5,33 | v43.1,42.6 42.25,43.45 C16.2 41.55,44.6 U2.15 U2.16
  pour Bottom (isolate 0.406): 65,49.6 40.2,49.6 40.2,43.9 38.6,43.9 38.6,41.9 44.5,41.9 44.5,33.4 41.6,33.4 41.6,27.6 47.6,27.6 47.6,7.2 65,7.2
BTN_1
  Top 0.254: S1.1 33.5,26.19 34.24,26.19 R30.2 33.95,29 32.8,29 32,29.8 32,31.9 30.6,33.3 27.24,33.3 U1.44
GND  (via drill 0.5, 0.6)
  Top 0.254: U1.16 12.63,40.13 C4.1 | U1.15 14.8,38.67 14.8,38.4 14.25,37.85 C3.1 11.4,38.55 | J6.6 v19.1,3.5 | U1.31 18.29,30.7 v17.1,30.7 | C5.2 14.2,29.05 v14.2,30.3 13.75,30.75 C2.1 | 11.35,39.5 v11.4,39.5 11.4,38.55 | C14.2 10.4,38.55 11.4,38.55 | C6.2 v15.4,25 | U1.47 24.56,38.1 v24.3,38.1 | U2.17 40.52,41.23 40.8,41.5 42.2,41.5 v42.9,40.8 41.9,39.8 41.2,39.8 40.67,39.27 U2.20 | C15.2 v37.2,32.9 | C12.2 v39.1,46.8
  Top 0.305: U1.4 16.85,44.4 v13.2,44.4 | 15.15,14.4 C21.1 14.5,13.75 | 16.6,15 U3.2 | J6.GND@2 14.15,3 v14.1,3 | J6.GND@4 28.5,10.8 v28.5,11.1 | J6.GND@1 28.5,2.9 v28.5,3.2 | C1.1 45.1,23.85 v45.1,21.7
  Top 0.406: BAT1.N- v10,13.6 | U4.2 41.9,26.8 v41.6,26.5 | C4.1 11.56,39.5 v11.4,39.5 | U5.2 15.5,47.4 14.65,48.25 C23.1 13.75,48.6 v12.7,48.6 | 15.15,14.4 16,14.4 16.6,15 | 14.5,13.75 v14.5,12 14.5,10.3 | J6.GND@3 14.5,10 14.5,10.3 | J6.CD_2 14.75,10.55 14.5,10.3 | C11.2 34,38.6 33.1,39.5 v33.1,40.4 | J1.5 5.13,41.9 J1.G3 | C13.2 C14.2 | C24.1 21.1,49.2 22,50.1 v22.3,50.1
  pour Bottom (isolate 0.254, rank 2): 0,0 65,0 65,56 0,56
JTAG_RST
  Top 0.254: JP1.15 R31.1 20.55,25.25 21.5,26.2 21.5,28.7 22.8,30 22.8,30.67 U1.34
JTAG_TCLK  (via drill 0.5)
  Top 0.254: U1.22 18.12,36.9 v22.1,36.9
  Bottom 0.254: v22.1,36.9 22.1,35.9 23.9,34.1 23.9,24.7 24.5,24.1 27.6,24.1 28.17,23.53 JP1.9
JTAG_TDI  (via drill 0.5)
  Top 0.254: U1.23 17.73,35.8 v23.4,35.8
  Bottom 0.254: v23.4,35.8 24.5,34.7 24.5,24.9 24.8,24.6 30.42,24.6 JP1.5
JTAG_TDO  (via drill 0.5)
  Top 0.254: U1.24 17.54,34.9 21.9,34.9 v22.1,34.7 | v22.3,26.7 22.3,26.2 21.5,25.4 21.5,23.1 22.83,21.77 JP1.13
  Bottom 0.254: v22.3,26.7 22.1,26.9 v22.1,34.7
JTAG_TMS  (via drill 0.5)
  Top 0.254: R32.1 35.2,24.3 33.8,22.9 31.6,22.9 31.1,23.4 | U1.25 17.65,34.3 21.4,34.3 21.8,33.9 22.8,33.9 v22.9,34 | v23.1,28.6 24.5,27.2 27.3,27.2 31.1,23.4 | JP1.7 31.1,22.16 31.1,23.4
  Bottom 0.254: v22.9,34 23.1,33.8 v23.1,28.6
LED_B
  Top 0.254: U1.56 25.8,42.45 25.8,46 25.15,46.65 R29.2
LED_G
  Top 0.254: U1.55 27.1,43.05 R1.1
LED_R
  Top 0.254: U1.54 27.06,42.3 28.1,42.3 29.2,43.4 R28.2
N$1
  Top 0.406: D11.A 6.9,45.2 6.85,45.15 6.2,44.5 J1.1
N$2
  Top 0.305: BAT1.P+@2 7.8,21.2 D2.A
  Top 0.406: BAT1.P+@1 3,10.79 3,16.7 6.5,20.2 BAT1.P+@2
N$3
  Top 0.254: R2.2 58.29,8.25 J2.P1
N$4
  Top 0.254: U1.32 18.1,29.8 18.1,28.7 16.3,26.9 Q1.3 15.75,27.25 C5.1
N$5
  Top 0.254: U1.33 20.25,29.3 Q1.1 19.8,29.3 18.35,27.85 C6.1
N$6
  Top 0.254: D3.1 D4.2 53.45,14.3 R4.1 | U2.2 47.48,34.73 48,34.2 48,16.6 48.8,15.8 49.6,15.8 50.2,15.2 D3.1 | D3.1 50.4,14.1 50.4,11.25 R3.1
N$7
  Top 0.254: R4.2 58.29,16.35 J2.P2 | R4.2 53.75,16.35 54.8,15.3 54.8,13.65 C7.2 | R4.2 53.45,16.5 D4.1 D3.2 48.9,16.5 48.5,16.9 48.5,34.5 47.62,35.38 U2.3
N$8
  Top 0.254: Q2.3 33.25,44.7 R14.2 | Q2.3 35.1,43.9 36.1,42.9 38,42.9 38.4,42.5 38.4,38.9 38.67,38.62 U2.21 | Q2.3 35.45,45.05 C12.1
N$9
  Top 0.254: R5.2 58.29,18.75 J3.P1
N$10
  Top 0.254: C13.1 7.8,34.72 Q3.1 7.41,33.79 8.4,32.8 11.1,32.8 11.3,33 11.3,33.6 11.8,34.1 13.91,34.1 U1.20
N$11
  Top 0.254: Q3.4 9.9,33.82 C14.1 11.65,34.6 13.7,34.6 U1.19
N$12
  Top 0.254: 51.5,12.05 C7.1 51.75,12 R2.1 53.4,10.15 R3.2
N$13
  Top 0.254: R7.1 51.95,24.95 D6.2 D5.1 | U2.4 48.48,36.02 49,35.5 49,25.2 49.4,24.8 D5.1 | D5.1 50.2,21.95 R6.1
N$14
  Top 0.254: R7.2 58.29,26.85 J3.P2 | R7.2 53.45,27 D6.1 D5.2 49.9,27 49.5,27.4 49.5,35.8 48.62,36.67 U2.5 | R7.2 53.75,26.85 54.8,25.8 54.8,24.15 C8.2
N$15
  Top 0.254: C8.1 51.75,22.5 R5.1 53.4,20.65 R6.2
N$16
  Top 0.254: R8.2 58.29,29.25 J4.P1
N$17
  Top 0.254: R10.1 53.55,35.4 D8.2 D7.1 | U2.6 49.17,37.33 50.2,36.3 D7.1 | D7.1 50.2,32.45 R9.1
N$18
  Top 0.254: R10.2 58.29,37.35 J4.P2 | R10.2 52.05,37.35 D8.1 D7.2 49.83,37.98 U2.7 | R10.2 54.05,37.35 54.8,36.6 54.8,34.65 C9.2
N$19
  Top 0.254: C9.1 51.75,33 R8.1 53.4,31.15 R9.2
N$20
  Top 0.254: R11.2 58.29,39.85 J5.P1
N$21
  Top 0.254: R13.1 53.45,45.9 D10.2 D9.1 | U2.8 47.62,38.62 48.5,39.5 48.5,45.5 48.9,45.9 D9.1 | D9.1 50.2,43.05 R12.1
N$22
  Top 0.254: R13.2 51.95,47.95 D10.1 D9.2 48.4,48.1 48,47.7 48,39.8 47.48,39.27 U2.9 | C10.2 53.5,43.9 54.8,45.2 54.8,46.75 R13.2 | R13.2 58.29,47.95 J5.P2
N$23
  Top 0.254: C10.1 51.75,43.6 R11.1 51.7,39.85 R12.2
N$24
  Top 0.254: U2.22 37.67,37.98 C11.1 37.05,40.25 Q2.1 35.55,42.65 R14.1
N$25
  Top 0.254: C16.1 44.65,44.6 U2.14
N$26
  Top 0.254: U2.27 40.48,34.73 40.7,34.5 40.7,32.85 R20.1
N$27
  Top 0.254: U2.1 46.73,32.27 C17.1 46.65,32 R22.1
N$28  (via drill 0.5)
  Top 0.254: v41.6,40.6 39.5,40.6 U2.18
  Bottom 0.254: R19.1 37.15,42.9 U2.18 41.58,40.58 v41.6,40.6
N$29  (via drill 0.5)
  Top 0.254: U2.26 41.17,35.38 v41.5,35.7
  Bottom 0.254: v41.5,35.7 38.25,35.7 R18.1
N$30  (via drill 0.5)
  Top 0.254: U2.25 40.62,36.02 41.5,36.9 41.8,36.9 v42.1,37.2
  Bottom 0.254: v42.1,37.2 37.65,37.2 R17.1
N$31  (via drill 0.5)
  Top 0.254: U2.24 40.58,36.67 41.1,37.2 41.1,37.7 v41.6,38.2
  Bottom 0.254: v41.6,38.2 37.55,38.2 R16.1
N$32  (via drill 0.5)
  Top 0.254: U2.23 40.42,37.33 40.6,37.5 40.6,38.4 41.3,39.1 v42.4,39.1
  Bottom 0.254: v42.4,39.1 42.2,39.3 38.55,39.3 R15.1
N$33  (via drill 0.5)
  Top 0.254: U1.17 14.79,37.1 v16,37.1
  Bottom 0.254: v16,37.1 14.95,36.05 C19.2
N$34
  Top 0.406: JP2.2 JP2.4 9.65,52.51 D12.A
N$35
  Top 0.254: D1.1 29.7,45.85 R28.1
N$36
  Top 0.254: R29.1 26.46,48.55 D1.3
N$37
  Top 0.254: D1.2 26.7,45.75 R1.2
N$38
  Top 0.254: R21.1 35.2,36.35 C15.1 37.35,36.2 38,36.2 38.4,35.8 38.4,34.4 38.73,34.08 U2.28
N$39  (via drill 2.75 pad 6.2)
  other vias: 3.5,3.5
N$40  (via drill 2.75 pad 6.2)
  other vias: 61.5,3.5
N$41
  Top 0.254: J1.2 6.55,43.85 6.8,44.1 9.05,44.1 R24.1
N$42
  Top 0.254: J1.3 8,43.2 R23.1
N$45  (via drill 2.75 pad 6.2)
  other vias: 61.5,52.5
N$46  (via drill 2.75 pad 6.2)
  other vias: 3.5,52.5
N$47
  Top 0.406: D13.A 14.95,21.25 JP1.19
N$50  (via drill 0.5)
  Top 0.406: U3.5 19.7,15.8 20.6,14.9 R27.2 23.45,13.45 v22.9,12.9 | v21.3,10.2 J6.4
  Bottom 0.406: v22.9,12.9 22.9,12.2 21.7,11 21.7,10.6 v21.3,10.2 20,8.9 C20.2
RPI_RX  (via drill 0.5)
  Top 0.254: JP2.10 19.8,52.5 19.8,50.4 19.2,49.8 v18.6,49.8 | v20.7,44.4 20.1,43.8 19.57,43.8 U1.1
  Bottom 0.254: v18.6,49.8 18.6,49 20.1,47.5 20.1,45.5 20.7,44.9 v20.7,44.4
RPI_TX  (via drill 0.5)
  Top 0.254: JP2.8 17.2,52.56 17.2,49.2 17.4,49 v17.8,49 | v19.6,44.9 19.4,45.1 18.7,45.1 18.3,44.7 18.3,44.36 U1.2
  Bottom 0.254: v17.8,49 19.6,47.2 v19.6,44.9
SD_CD  (via drill 0.5)
  Top 0.254: U1.60 22.7,42.18 22.7,40.9 23.3,40.3 v23.3,37.2 | v26.9,17 26.9,16.45 R27.1 27.05,13.2 J6.CD_1 | v26.9,23.2 26.9,23.3 25.3,24.9 v25.3,25.4
  Bottom 0.254: v26.9,17 v26.9,23.2 | v25.3,25.4 25.1,25.6 25.1,35.7 23.6,37.2 v23.3,37.2
SD_CS  (via drill 0.5)
  Top 0.254: U1.61 22.2,42.39 v22.2,39.9 | v23.5,10.9 J6.2
  Bottom 0.254: v22.2,39.9 20.9,39.9 20.9,25.7 23.1,23.5 23.9,23.5 24.3,23.1 24.3,11.7 v23.5,10.9
SD_MISO  (via drill 0.5)
  Top 0.254: v18,11.1 J6.7 | v20.2,41.7 20.2,43 20.7,43.5 21.19,43.5 U1.64
  Bottom 0.254: v18,11.1 19.2,12.3 19.2,24.7 19.9,25.4 19.9,41.7 v20.2,41.7
SD_MOSI  (via drill 0.5)
  Top 0.254: v16.8,12 22.1,12 22.4,11.7 J6.3 | v21,42.7 21.1,42.7 U1.63
  Bottom 0.254: v16.8,12 16.8,25.1 17.2,25.5 18.6,25.5 19.4,26.3 19.4,42.6 19.5,42.7 v21,42.7
SD_SCK  (via drill 0.5)
  Top 0.254: U1.62 21.7,42.6 21.7,41.1 21.4,40.8 v21.4,40.7 | v20.1,10.9 20.1,1.43 J6.5
  Bottom 0.254: v21.4,40.7 20.4,40.7 20.4,25.4 21.8,24 21.8,12.6 v20.1,10.9
USB_D+
  Top 0.254: R23.2 8.25,41.15 9.2,42.1 11.3,42.1 12.8,43.6 16.94,43.6 U1.5
USB_D-
  Top 0.254: R24.2 11.15,41.15 13.1,43.1 16.73,43.1 U1.6
VBAT
  Top 0.254: U1.21 15.3,34.8 14.1,33.6 13,33.6 12.4,33 12.4,32.25 C2.2 12.05,27.55 11.2,26.7 8.4,26.7 7.8,26.1 7.8,25.75 8.25,25.3 D2.C

### Text on the board
Top: 1
Bottom: 2
tNames: 1 | SeismicPi | Prototype 1